# Altium schematic sheet Sheet1.SchDoc
size 431 x 279 mm; SheetNumber: 1; SheetTotal: 1; ENG_APP_DATE: --/--/--; DSN_APP_DATE: --/--/--; CHK_APP_DATE: --/--/--
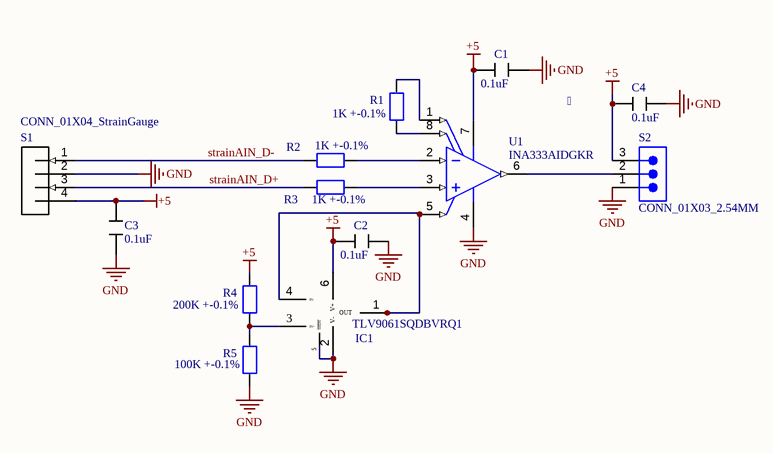
[diagram p0: Sheet1.SchDoc]

## Parts
C1  0.1uF  [CAP_0805]
C2  0.1uF  [CAP_0805]
C3  0.1uF  [CAP_0805]
C4  0.1uF  [CAP_0805]
IC1  TLV9061SQDBVRQ1  [SOT95P280X145-6N]
R1  1K +-0.1%  [RES_0805]
R2  1K +-0.1%  [RES_0805]
R3  1K +-0.1%  [RES_0805]
R4  200K +-0.1%  [RES_0805]
R5  100K +-0.1%  [RES_0805]
S1  CONN_01X04_StrainGauge  [CONN_01X04]
S2  CONN_01X03_2.54MM  [61300311121]
U1  INA333AIDGKR  [DGK0008A_N]

## Nets
+5: C1.1 C2.1 C3.2 C4.2 IC1.6(V+) R4.2 S1.4 S2.3 U1.7(V+)
GND: C1.2 C2.2 C3.1 C4.1 IC1.2(V-) IC1.5(~{SHDN}) R5.1 S1.2 S2.1 U1.4(V-)
strainAIN_D+: R3.2 S1.3
strainAIN_D-: R2.2 S1.1
NetIC1_1: IC1.1(OUT) IC1.4(IN-) U1.5(REF)
NetIC1_3: IC1.3(IN+) R4.1 R5.2
NetR1_1: R1.1 U1.8(RG)
NetR1_2: R1.2 U1.1(RG)
NetR2_1: R2.1 U1.2(VIN-)
NetR3_1: R3.1 U1.3(VIN+)
NetS2_2: S2.2 U1.6(VOUT)

## Notes on the sheet
- 
- DWG. NO.
- REV.
- SHT.
- THIS DOCUMENT AND THE DATA DISCLOSED HEREIN OR HEREWITH IS THE PROPERTY OF ALTIUM LIMITED AND MAY BE FREELY DISTRIBUTED IN WHOLE. NO RIGHTS ARE RESERVED OR EXPRESS OR IMPLIED WARANTEE GIVEN.
- REVISION
- DESCRIPTION
- DATE
- APPROVED
- ENG:
- APPROVALS
- PROJECT
- DSN:
- CHK:
- REFERENCE DOCUMENTS
- PROJECT REVISION:
- TITLE
- DOCUMENT REVISION:
- DESIGN ITEM:
- BOM:
- FAB DWG:
- PCB DWG:
- ASSY DWG:
- SCALE:
- SIZE
- B
- CAGE CODE
- FILE NAME
- DWG NO.
- SHEET
- OF
- REV

## Library data of the parts
C1-C4 = CAP_0805: Generic 0805 component; Manufacturer: YAGEO; Manufacturer part number: CC0805JRNPO9BN250; voltage rating: 50; Distributor link: https://www.digikey.ca/en/products/detail/yageo/CC0805JRNPO9BN250/5884044
IC1 = TLV9061SQDBVRQ1: Integrated Circuit; Manufacturer_Name: Texas Instruments; Datasheet Link: https://www.ti.com/lit/gpn/tlv9061-q1; Height: 1.45mm; Manufacturer_Part_Number: TLV9061SQDBVRQ1; Mouser Part Number: 595-TLV9061SQDBVRQ1; Mouser Price/Stock: https://www.mouser.co.uk/ProductDetail/Texas-Instruments/TLV9061SQDBVRQ1?qs=DRkmTr78QASJ%252B5bCrdR4jA%3D%3D; Arrow Part Number: TLV9061SQDBVRQ1; Arrow Price/Stock: null?region=nac
R1-R3 = RES_0805: Manufacturer part number: RNCS0805BKE1K00; Manufacturer: Stackpole Electronics Inc; Distributor link: https://www.digikey.ca/en/products/detail/stackpole-electronics-inc/RNCS0805BKE1K00/1800073
R4 = RES_0805: Manufacturer part number: RN73R2ATTD2003B25; Manufacturer: KOA Speer Electronics, Inc.; Distributor link: https://www.digikey.ca/en/products/detail/koa-speer-electronics-inc/RN73R2ATTD2003B25/10027580
R5 = RES_0805: Manufacturer part number: RNCS0805BKE100K; Manufacturer: Stackpole Electronics Inc; Distributor link: https://www.digikey.ca/en/products/detail/stackpole-electronics-inc/RNCS0805BKE100K/1800066
U1 = CMP-0944-00088-2: Low Power, Precision Instrumentation Amplifier, -40 to 125 degC, 8-pin SOP (DGK8), Green (RoHS & no Sb/Br); Manufacturer: Texas Instruments; Input Offset Drift (+/-)(Max)(uV/Degrees Celsius): 0.1; Vs(Max)(V): 5.5; Input Bias Current (+/-)(Max)(nA): 0.2; Output Offset (+/-)(Max)(uV): 75/G; CMRR(Min)(dB): 100; Noise at 1kHz(Typ)(nV/rt(Hz)): 50; Output Offset Drift (+/-)(Max)(uV/Degrees Celsius): 0.5/G; Vs(Min)(V): 1.8; Quiescent Current (+/-)(Typ)(mA): 0.05; Gain(V/V): 1 to 1000; SubFamily: Single Supply; Number of Channels: 1; Input Offset (+/-)(Max)(uV): 25; Code_JEDEC: MO-187; Eco-Plan: Green (RoHS & no Sb/Br); ComponentLink2URL: http://www.ti.com/general/docs/lit/getliterature.tsp?genericPartNumber=INA333&fileType=pdf; Mounting Technology: Surface Mount; PartNumber: INA333AIDGKR; ComponentLink3URL: http://www.ti.com/litv/pdf/mpds028d; ComponentLink1URL: http://www.ti.com/; DatasheetVersion: SBOS445B; ComponentLink2Description: Datasheet; PackageVersion: 4073329/E, 05/2006; PackageReference: DGK0008A; ComponentLink3Description: Package Specification; PackageDescription: 8-Pin Thin Small Outline, Body 3 x 3 mm, Pitch 0.65 mm; ComponentLink1Description: Manufacturer URL